# EAGLE design NanoRS485-MySens-v008 (EAGLE 7.6.0)
MAPLE-CUx Large Version
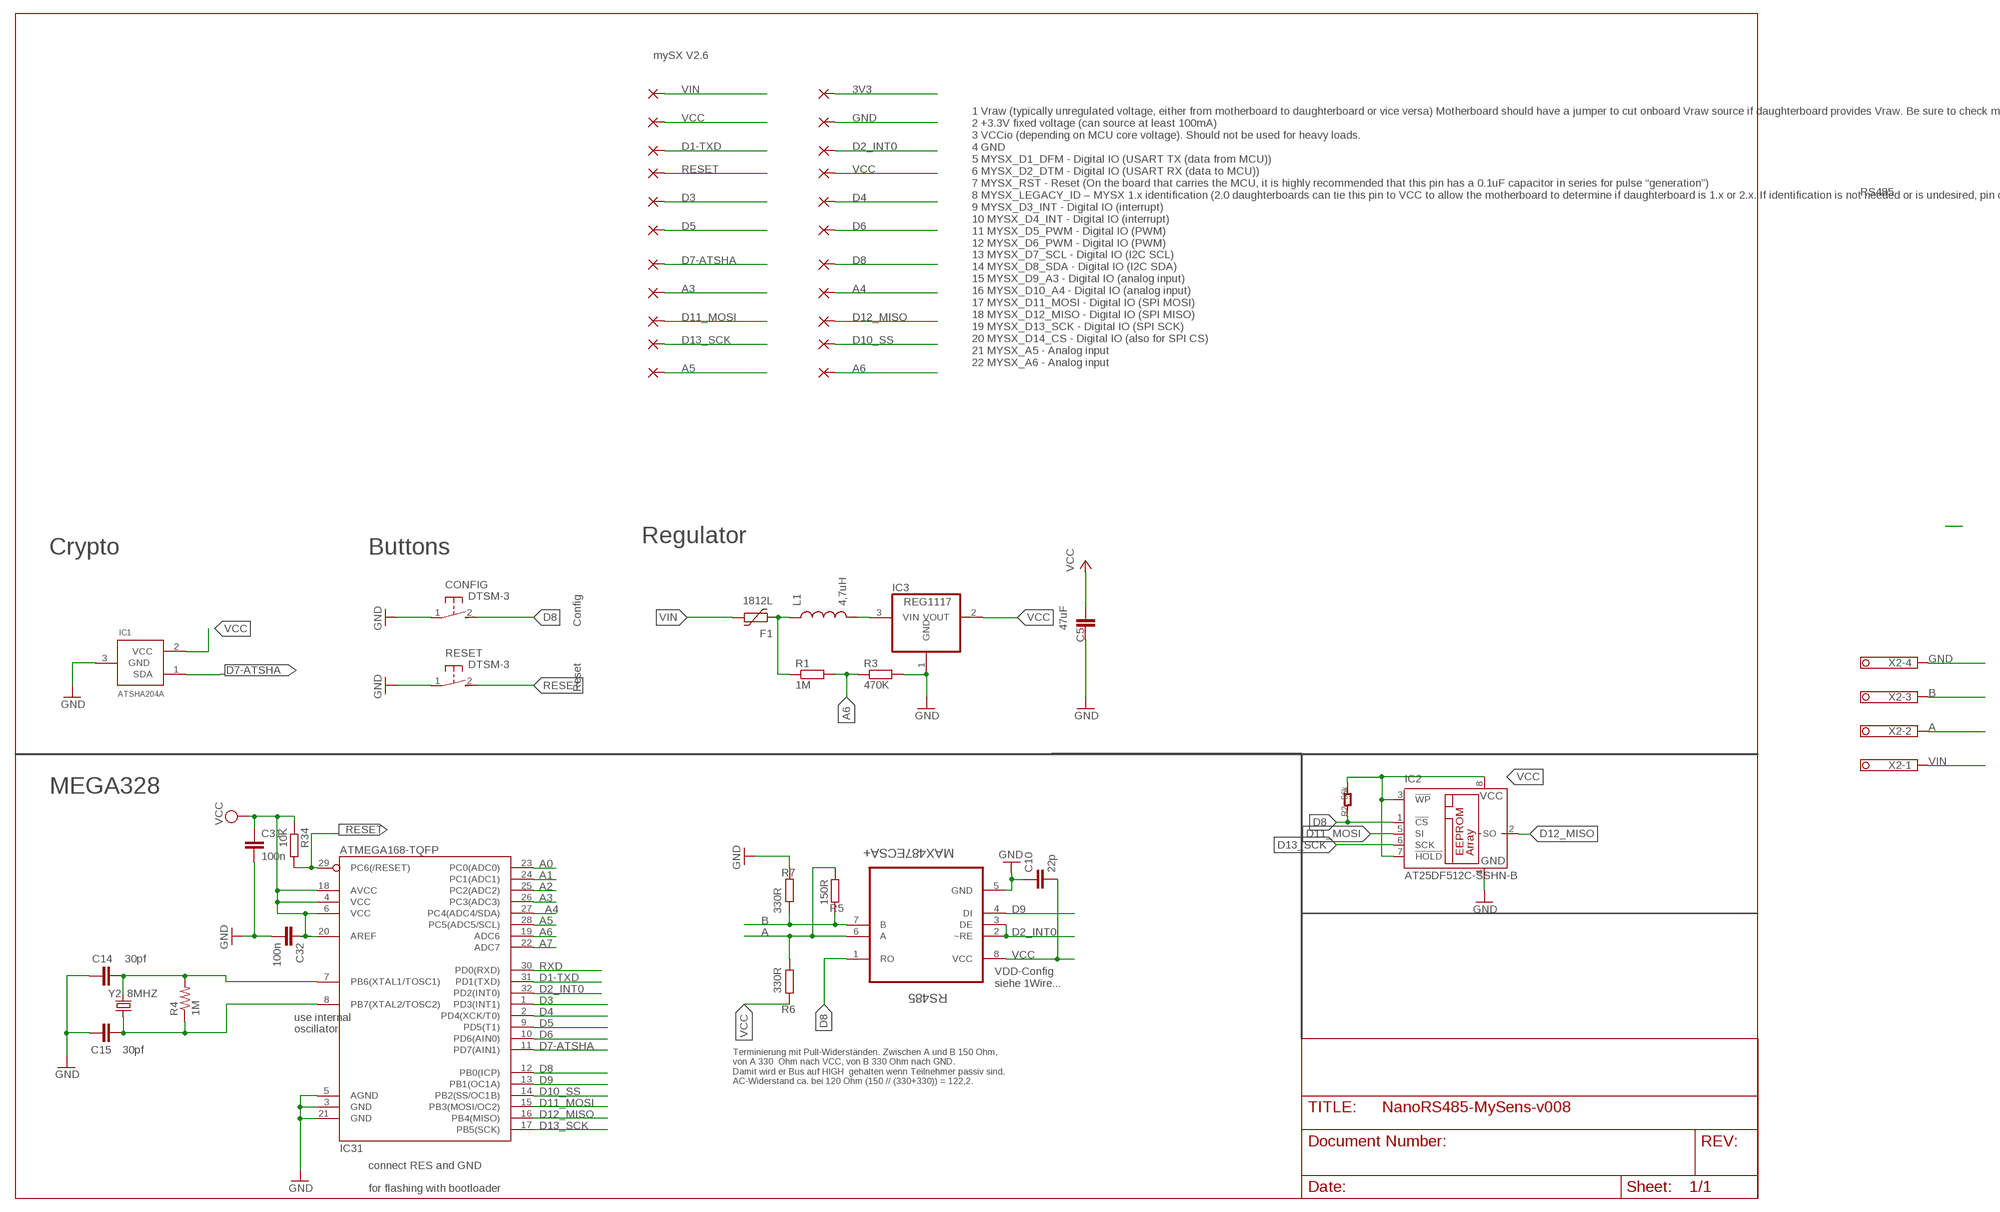
[diagram p0: schematic, sheet 1]

## Parts
3V3  WIREPADSMD1,27-254  [SMD1,27-2,54]
A3  WIREPADSMD1,27-254  [SMD1,27-2,54]
A4  WIREPADSMD1,27-254  [SMD1,27-2,54]
A5  WIREPADSMD1,27-254  [SMD1,27-2,54]
A6  WIREPADSMD1,27-254  [SMD1,27-2,54]
C5  47uF  C-EUC1210  [C1210]
C10  22p  C-EUC0805  [C0805]
C14  30pf  CAP0805  [0805]
C15  30pf  CAP0805  [0805]
C31  100n  C-EUC0805  [C0805]
C32  100n  C-EUC0805  [C0805]
CONFIG  DTSM-3  [DTSM-3]
D1  WIREPADSMD1,27-254  [SMD1,27-2,54]
D2  WIREPADSMD1,27-254  [SMD1,27-2,54]
D3  WIREPADSMD1,27-254  [SMD1,27-2,54]
D4  WIREPADSMD1,27-254  [SMD1,27-2,54]
D5  WIREPADSMD1,27-254  [SMD1,27-2,54]
D6  WIREPADSMD1,27-254  [SMD1,27-2,54]
D7  WIREPADSMD1,27-254  [SMD1,27-2,54]
D8  WIREPADSMD1,27-254  [SMD1,27-2,54]
D10-SS  WIREPADSMD1,27-254  [SMD1,27-2,54]
D11  WIREPADSMD1,27-254  [SMD1,27-2,54]
D12  WIREPADSMD1,27-254  [SMD1,27-2,54]
D13-SCK  WIREPADSMD1,27-254  [SMD1,27-2,54]
F1  1812L  [1812L]
GND  WIREPADSMD1,27-254  [SMD1,27-2,54]
IC1  ATSHA204A  [SOT23]
IC2  AT25DF512C-SSHN-B  25AA080SN  [SO-08]
IC3  REG1117  [SOT223]
IC31  ATMEGA168-TQFP  [TQFP32-08]
L1  4,7uH  INDUCTOR0805  [0805]
R1  1M  R-EU_R0805  [R0805]
R2  56k  R-0402  [R0402]
R3  470K  R-EU_R0805  [R0805]
R4  1M  RESISTOR0805-RES  [0805]
R5  150R  R-EU_R0805  [R0805]
R6  330R  R-EU_R0805  [R0805]
R7  330R  R-EU_R0805  [R0805]
R34  10K  R-EU_R0805  [R0805]
RES  WIREPADSMD1,27-254  [SMD1,27-2,54]
RESET  DTSM-3  [DTSM-3]
RS485  MAX487ECSA+  [SOIC127P600X175-8N]
VCC  WIREPADSMD1,27-254  [SMD1,27-2,54]
VCC-LEGACY  WIREPADSMD1,27-254  [SMD1,27-2,54]
VIN  WIREPADSMD1,27-254  [SMD1,27-2,54]
X2  1751264  [1751264]
Y2  8MHZ  CRYSTALTXC-7A  [CRYSTAL-TXC-7A]

## Nets
3V3 [PWR]: 3V3.1(P)
A: R5.1 R6.2 RS485.6(A) X2.2
A0: IC31.23(PC0(ADC0))
A1: IC31.24(PC1(ADC1))
A2: IC31.25(PC2(ADC2))
A3: A3.1(P) IC31.26(PC3(ADC3))
A4: A4.1(P) IC31.27(PC4(ADC4/SDA))
A5: A5.1(P) IC31.28(PC5(ADC5/SCL))
A6: A6.1(P) IC31.19(ADC6) R1.2 R3.1
A7: IC31.22(ADC7)
B: R5.2 R7.1 RS485.7(B) X2.3
D1-TXD: D1.1(P) IC31.31(PD1(TXD))
D2_INT0: D2.1(P) IC31.32(PD2(INT0)) RS485.2(~RE) RS485.3(DE)
D3: D3.1(P) IC31.1(PD3(INT1))
D4: D4.1(P) IC31.2(PD4(XCK/T0))
D5: D5.1(P) IC31.9(PD5(T1))
D6: D6.1(P) IC31.10(PD6(AIN0))
D7-ATSHA: D7.1(P) IC1.1(SDA) IC31.11(PD7(AIN1))
D8: CONFIG.2 D8.1(P) IC2.1(!CS) IC31.12(PB0(ICP)) R2.1 RS485.1(RO)
D9: IC31.13(PB1(OC1A)) RS485.4(DI)
D10_SS: D10-SS.1(P) IC31.14(PB2(SS/OC1B))
D11_MOSI: D11.1(P) IC2.5(SI) IC31.15(PB3(MOSI/OC2))
D12_MISO: D12.1(P) IC2.2(SO) IC31.16(PB4(MISO))
D13_SCK: D13-SCK.1(P) IC2.6(SCK) IC31.17(PB5(SCK))
GND [PWR]: C5.1 C10.1 C14.1 C15.1 C31.2 C32.2 CONFIG.1 GND.1(P) IC1.3(GND) IC2.4(GND) IC3.1(GND) IC31.3(GND) IC31.5(AGND) IC31.21(GND) R3.2 R7.2 RESET.1 RS485.5(GND) X2.4
N$3: C14.2 IC31.7(PB6(XTAL1/TOSC1)) R4.2 Y2.P$2
N$19: C15.2 IC31.8(PB7(XTAL2/TOSC2)) R4.1 Y2.P$1
RAW: IC3.3(VIN) L1.2
RESET: IC31.29(PC6(/RESET)) R34.2 RES.1(P) RESET.2
RXD: IC31.30(PD0(RXD))
VCC [PWR]: C5.2 C10.2 C31.1 C32.1 IC1.2(VCC) IC2.3(!WP) IC2.7(!HOLD) IC2.8(VCC) IC3.2(VOUT) IC31.4(VCC) IC31.6(VCC) IC31.18(AVCC) IC31.20(AREF) R2.2 R6.1 R34.1 RS485.8(VCC) VCC-LEGACY.1(P) VCC.1(P)
VIN [PWR]: F1.P$2 VIN.1(P) X2.1
VIN-FUSED [PWR]: F1.P$1 L1.1 R1.1

## Notes on the sheet
- mySX V2.6
- RS485
- 1 Vraw (typically unregulated voltage, either from motherboard to daughterboard or vice versa) Motherboard should have a jumper to cut onboard Vraw source if daughterboard provides Vraw. Be sure to check motherboard constraints on Vraw before connecting a daughterboard that provides Vraw (for over voltage protection). Should be able to source at least 100mA and all boards are recommended to support a voltage up to 24V on this pin.
  2 +3.3V fixed voltage (can source at least 100mA)
  3 VCCio (depending on MCU core voltage). Should not be used for heavy loads.
  4 GND
  5 MYSX_D1_DFM - Digital IO (USART TX (data from MCU))
  6 MYSX_D2_DTM - Digital IO (USART RX (data to MCU))
  7 MYSX_RST - Reset (On the board that carries the MCU, it is highly recommended that this pin has a 0.1uF capacitor in series for pulse “generation”)
  8 MYSX_LEGACY_ID – MYSX 1.x identification (2.0 daughterboards can tie this pin to VCC to allow the motherboard to determine if daughterboard is 1.x or 2.x. If identification is not needed or is undesired, pin can be used as regular analog input)
  9 MYSX_D3_INT - Digital IO (interrupt)
  10 MYSX_D4_INT - Digital IO (interrupt)
  11 MYSX_D5_PWM - Digital IO (PWM)
  12 MYSX_D6_PWM - Digital IO (PWM)
  13 MYSX_D7_SCL - Digital IO (I2C SCL)
  14 MYSX_D8_SDA - Digital IO (I2C SDA)
  15 MYSX_D9_A3 - Digital IO (analog input)
  16 MYSX_D10_A4 - Digital IO (analog input)
  17 MYSX_D11_MOSI - Digital IO (SPI MOSI)
  18 MYSX_D12_MISO - Digital IO (SPI MISO)
  19 MYSX_D13_SCK - Digital IO (SPI SCK)
  20 MYSX_D14_CS - Digital IO (also for SPI CS)
  21 MYSX_A5 - Analog input
  22 MYSX_A6 - Analog input
- Regulator
- Crypto | Buttons
- Config
- Reset
- MEGA328
- VDD-Config
  siehe 1Wire...
- use internal
- oscillator
- Terminierung mit Pull-Widerständen. Zwischen A und B 150 Ohm,
  von A 330  Ohm nach VCC, von B 330 Ohm nach GND. 
  Damit wird er Bus auf HIGH  gehalten wenn Teilnehmer passiv sind.
  AC-Widerstand ca. bei 120 Ohm (150 // (330+330)) = 122,2.
- connect RES and GND
- for flashing with bootloader

## Library data of the parts
3V3 A3-A6 D1-D8 D10-SS D11 D12 D13-SCK GND RES VCC VCC-LEGACY VIN = wirepad:WIREPAD: Wire PAD connect wire on PCB
C5 C10 C31 C32 = rcl:C-EU: CAPACITOR, European symbol
C14 C15 = doug:CAP: Capacitor Standard 0603 ceramic capacitor, and 0.1" leaded capacitor.
CONFIG RESET = mechanics:DTSM-3: Diptronics SMD button 6x3.5 mm
F1 = ptc-littlefuse:1812L
IC1 = Sensor:ATSHA204A
IC2 = microchip:25*: Serial EEPROM 4K/ 8K , SPI bus; MF: MICROCHIP; MPN: 25AA080/SN; OC_FARNELL: 1816072; OC_NEWARK: 92C7351
IC3 = burr-brown:REG1117: 800mA and 1A Low Dropout (LDO) Positive Regulator 1.8V, 2.5V, 2.85V, 3.3V, 5V, and Adj; MPN: REG1117; OC_FARNELL: 1097566; OC_NEWARK: 14P6981
IC31 = atmel:ATMEGA168: Atmel Atmega 168/328/328P
L1 = SparkFun-Passives:INDUCTOR: Inductors Basic Inductor/Choke - 0603 and 1206. Footprints are not proven and vary greatly between part numbers.
R1 R3 R5-R7 R34 = rcl:R-EU_: RESISTOR, European symbol
R2 = Discrete:R*
R4 = doug:RESISTOR: Resistor Basic schematic elements and footprints for 0603, 1206, and PTH resistors.
RS485 = Maxim_By_element14_Batch_1:MAX487ECSA+: Low-Power, Slew-Rate-Limited RS-485/RS-422 Transceivers; MPN: MAX487ECSA+; OC_FARNELL: 9724532; OC_NEWARK: 68K4803; PACKAGE: SOIC-8; SUPPLIER: Maxim
X2 = con-phoenix-350:1751264: MKDS 1/ 4-3,5 Printklemme Nennstrom: 10 A Bemessungsspannung: 160 V Raster: 3,5 mm Polzahl: 4 Montageart: Löten Anschlussart: Schraubanschluss Anschlussrichtung vom Leiter zur Platine: 0° Source: http://eshop.phoenixcontact.com .. 1751264.pdf; MPN: 1751264; OC_FARNELL: unknown; OC_NEWARK: 10R0934
Y2 = SparkFun-FreqCtrl:CRYSTAL: Various standard crystals. Proven footprints.

## Net classes
0 default: width 0.254 mm
1 PWR: width 0.406 mm

## Board
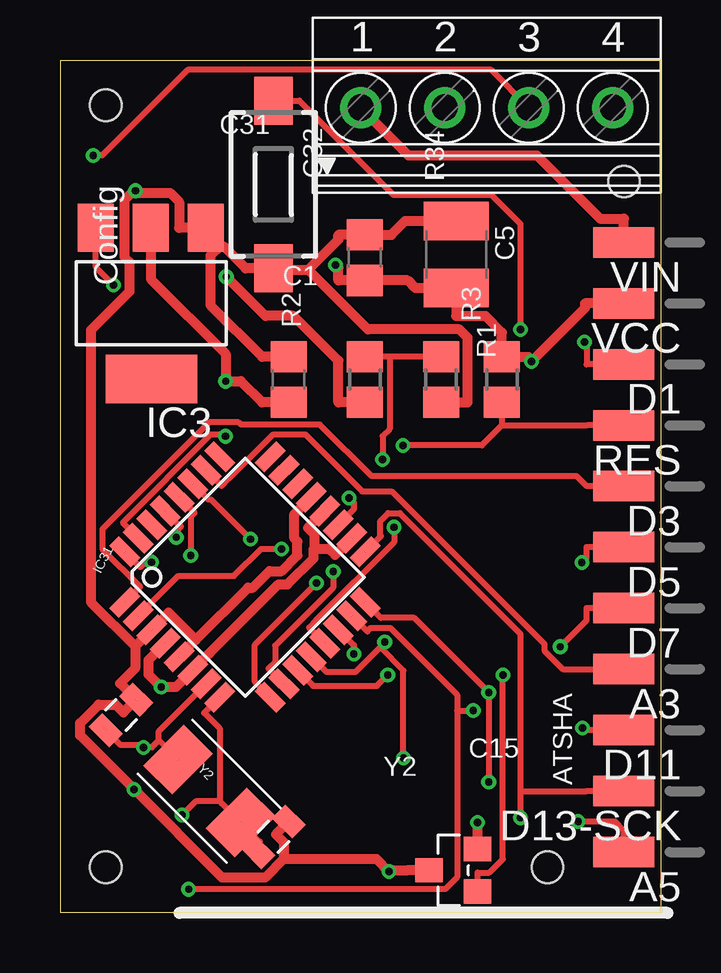
[diagram p1: board, top side]
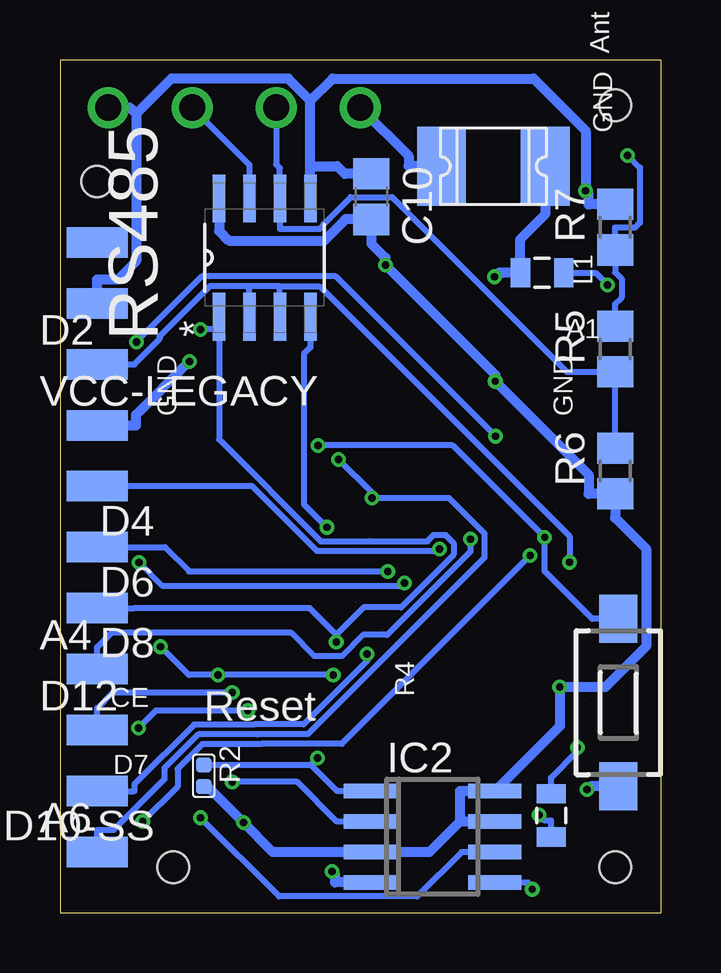
[diagram p2: board, bottom side, seen from below]

Size 25.04 x 35.54 mm. Coordinates in mm from the lower left corner, seen from the top.
Outline: 25.04,35.54 25.04,0 0,0 0,35.54 25.04,35.54
Copper layers (1*16): Top 0.035mm / dielectric 1.5mm / Bottom 0.035mm
Design rules "SeeedStudio_2layer_DRU_no_angle_20140221": minimum track width 6mil, minimum drill 12mil, track to track 6mil, track to pad 6mil, pad to pad 6mil, via to via 6mil, smd to smd 0mil, copper to edge 10mil, drill to drill 10mil, minimum pad ring 10mil, minimum via ring 6mil, stop-mask expansion 2mil, vias tented up to drill 100mil, thermal gap 10mil
Holes 1.3 mm at 23.5,30.48 1.91,33.66 20.32,1.91 1.91,1.91

### Footprints (pad centres in the part's own frame; a part is rotated, then mirrored left to right if it is on the bottom)
SMD1,27-2,54 = smd 1.27 x 2.54: 1 0,0
C1210 = smd 1.6 x 2.7: 1 -1.4,0; 2 1.4,0
C0805 = smd 1.3 x 1.5: 1 -0.95,0; 2 0.95,0
0805 = smd 0.8 x 1.2: 1 -0.9,0; 2 0.9,0
DTSM-3 = smd 2 x 1.6: 1 -3.494,0; 2 3.494,0
1812L = smd 2.03 x 3.3: P$1 -2.16,0; P$2 2.16,0
SOT23 = smd 1.016 x 1.143: 1 -0.889,-1.016; 2 0.889,-1.016; 3 0,1.016
SO-08 = smd 0.6 x 2.2: 1 -1.905,-2.6; 2 -0.635,-2.6; 3 0.635,-2.6; 4 1.905,-2.6; 5 1.905,2.6; 6 0.635,2.6; 7 -0.635,2.6; 8 -1.905,2.6
SOT223 = smd 1.499 x 2.007: 1 -2.261,-3.15; 2 0.025,-3.15; 3 2.311,-3.15 | smd 3.81 x 2.007: 4 0,3.15
TQFP32-08 = smd 1.27 x 0.559: 1 -4.293,2.8; 2 -4.293,2; 3 -4.293,1.2; 4 -4.293,0.4; 5 -4.293,-0.4; 6 -4.293,-1.2; 7 -4.293,-2; 8 -4.293,-2.8; 17 4.293,-2.8; 18 4.293,-2; 19 4.293,-1.2; 20 4.293,-0.4; 21 4.293,0.4; 22 4.293,1.2; 23 4.293,2; 24 4.293,2.8 | smd 0.559 x 1.27: 9 -2.8,-4.293; 10 -2,-4.293; 11 -1.2,-4.293; 12 -0.4,-4.293; 13 0.4,-4.293; 14 1.2,-4.293; 15 2,-4.293; 16 2.8,-4.293; 25 2.8,4.293; 26 2,4.293; 27 1.2,4.293; 28 0.4,4.293; 29 -0.4,4.293; 30 -1.2,4.293; 31 -2,4.293; 32 -2.8,4.293
R0805 = smd 1.3 x 1.5: 1 -0.95,0; 2 0.95,0
R0402 = smd 0.635 x 0.635: 1 0,0.445; 2 0,-0.445
SOIC127P600X175-8N = smd 1.981 x 0.533: 1 -2.464,1.905; 2 -2.464,0.635; 3 -2.464,-0.635; 4 -2.464,-1.905; 5 2.464,-1.905; 6 2.464,-0.635; 7 2.464,0.635; 8 2.464,1.905
1751264 = drill 1.1 pad 1.7: 1 -5.25,-0.1; 2 -1.75,-0.1; 3 1.75,-0.1; 4 5.25,-0.1
CRYSTAL-TXC-7A = smd 1.7 x 2.4: P$1 1.85,0; P$2 -1.85,0

### Placement (x,y rotation side)
3V3  23.5,27.94 90 bottom
A3  23.5,10.16 90 top
A4  23.5,10.16 270 bottom
A5  23.5,2.54 90 top
A6  23.5,2.54 270 bottom
C5  16.51,27.43 270 top
C10  12.06,29.84 270 bottom
C14  2.54,8.26 225 top
C15  8.89,3.17 225 top
C31  12.7,27.3 90 top
C32  9.53,22.23 90 top
CONFIG  8.89,30.35 90 top
D1  23.5,22.86 90 top
D2  23.5,22.86 270 bottom
D3  23.5,17.78 90 top
D4  23.5,17.78 90 bottom
D5  23.5,15.24 90 top
D6  23.5,15.24 90 bottom
D7  23.5,12.7 90 top
D8  23.5,12.7 90 bottom
D10-SS  23.5,5.08 90 bottom
D11  23.5,7.62 90 top
D12  23.5,7.62 270 bottom
D13-SCK  23.5,5.08 90 top
F1  6.99,31.11 180 bottom
GND  23.5,25.4 90 bottom
IC1  16.38,1.78 90 top
IC2  9.53,3.17 270 bottom
IC3  3.81,25.4 180 top
IC31  7.71,14 45 top
L1  4.95,26.67 0 bottom
R1  12.7,22.23 90 top
R2  19.05,5.71 0 bottom
R3  15.88,22.23 270 top
R4  4.57,4.06 90 bottom
R5  1.91,23.5 90 bottom
R6  1.91,18.41 90 bottom
R7  1.91,28.57 90 bottom
R34  18.41,22.23 270 top
RES  23.5,20.32 90 top
RESET  1.78,8.76 90 bottom
RS485  16.51,27.3 90 bottom
VCC  23.5,25.4 90 top
VCC-LEGACY  23.5,20.32 270 bottom
VIN  23.5,27.94 90 top
X2  17.78,33.66 0 top
Y2  6.22,5.08 315 top

### Tracks (layer width: path | path; a pad name or v marks a point on that pad's centre or on a via)
A
  Bottom 0.254: R6.2 R5.1 3.92,22.55 11.2,29.82 12.93,29.82 14.06,28.7 14.06,28.66 14.22,28.5 15.88,28.5 RS485.6 15.88,30.3 15.88,31.04 16.03,31.19 X2.2
A3  (1 unrouted)
  Top 0.254: IC31.26 6.74,17.8 7.02,18.08 7.03,18.08 8.89,19.94 10.22,19.94 12.59,17.57 13.82,17.57 20.18,11.21 20.18,10.93 20.95,10.16 A3.1
A4  (via drill 0.3 pad 0.61)  (1 unrouted)
  Top 0.254: IC31.27 6.17,17.23 6.28,17.23 v7.94,15.57
  Bottom 0.254: v7.94,15.57 7.94,15.05 11.41,11.59 12.41,11.59 13.29,10.71 14.44,10.71 15.41,11.68 22.89,11.68 23.5,11.07 A4.1
A5  (via drill 0.3 pad 0.61)  (1 unrouted)
  Top 0.254: IC31.28 5.61,16.67 5.45,16.51 v5.45,14.89 | v21.59,3.82 23.13,3.82 23.5,3.45 A5.1
  Bottom 0.254: v5.45,14.89 13.3,7.05 16.63,7.05 16.64,7.04 19.11,7.04 20.14,6 20.14,5.27 v21.59,3.82
A6  (via drill 0.3 pad 0.61)  (1 unrouted)
  Top 0.254: 13.73,23.18 13.73,20.16 13.44,19.87 v13.44,18.9 | 13.73,23.18 R1.2 | R3.1 13.73,23.18 | v12.04,17.3 12.24,17.09 12.24,16.83 IC31.19
  Bottom 0.254: v13.44,18.9 12.04,17.5 v12.04,17.3 8.83,17.3 7.36,15.82 7.36,14.81 14.71,7.45 16.8,7.45 16.81,7.44 19.28,7.44 20.69,6.03 20.69,5.58 22.82,3.45 23.5,3.45 A6.1
B  (via drill 0.3 pad 0.61)
  Top 0.254: X2.3 17.96,35.13 5.31,35.13 1.75,31.57 v1.39,31.57
  Bottom 0.254: X2.3 17.14,31.17 RS485.7 | v1.39,31.57 0.88,31.05 0.88,28.76 1.08,28.55 1.91,28.55 R7.1 1.91,26.7 1.64,26.43 1.64,25.64 1.91,25.37 R5.2
D1-TXD  (via drill 0.3 pad 0.61)  (1 unrouted)
  Top 0.254: v21.86,23.79 21.95,23.7 21.95,22.86 D1.1 | v6.89,19.86 6.81,19.94 6.29,19.94 2.62,16.26 IC31.31
  Bottom 0.254: v6.89,19.86 13.55,26.52 19.12,26.52 v21.86,23.79
D2_INT0  (via drill 0.3 pad 0.61)  (1 unrouted)
  Top 0.254: IC31.32 3.34,14.4 3.55,14.62 v3.81,14.62
  Bottom 0.254: 15.88,26.11 14.22,26.11 3.81,15.7 v3.81,14.62 | 15.88,26.11 15.88,26.01 RS485.3 | 15.88,26.11 17.14,26.11 | 17.14,26.11 18.8,26.11 20.89,24.03 20.89,23.92 21.95,22.86 D2.1 | RS485.2 17.14,26.11
D3  (1 unrouted)
  Top 0.254: D3.1 21.95,17.78 21.53,18.2 12.98,18.2 10.83,20.35 7.55,20.35 7.45,20.45 6.22,20.45 1.77,16 1.77,15.16 3.34,13.59 IC31.1
D4  (via drill 0.3 pad 0.61)  (1 unrouted)
  Top 0.254: IC31.2 4.93,14.04 7.25,14.04 8.38,15.17 v9.23,15.17
  Bottom 0.254: v9.23,15.17 9.32,15.08 14.33,15.08 17.03,17.78 D4.1
D5  (via drill 0.3 pad 0.61)  (1 unrouted)
  Top 0.254: v10.69,13.74 8.12,11.18 8.12,9.63 IC31.9 | v21.74,14.61 21.95,14.81 21.95,15.24 D5.1
  Bottom 0.254: v21.74,14.61 20.78,13.64 10.79,13.64 v10.69,13.74
D6  (via drill 0.3 pad 0.61)  (1 unrouted)
  Top 0.254: IC31.10 8.69,10.19 8.97,10.47 8.97,11.13 11.38,13.55 v11.38,14.23
  Bottom 0.254: D6.1 20.67,15.24 19.66,14.23 v11.38,14.23
D7-ATSHA  (via drill 0.3 pad 0.61)  (1 unrouted)
  Top 0.254: D7.1 21.95,12.7 21.95,12.19 v20.85,11.09 | v18.45,9.92 18.45,2.25 17.88,1.68 17.4,1.68 IC1.1 | IC31.11 10.54,9.47 13.21,9.47 v13.66,9.92
  Bottom 0.254: v20.85,11.09 19.67,9.92 v18.45,9.92 v13.66,9.92
D8  (via drill 0.3 pad 0.61)  (1 unrouted)
  Top 0.254: 13.34,11.06 12.31,10.03 11.11,10.03 IC31.12 | v13.53,11.29 13.53,11.26 13.34,11.06 | v14.31,6.46 14.31,10.1 13.34,11.06 | v19.19,24.32 19.19,28.7 17.98,29.91 13.9,29.91 9.97,33.85 CONFIG.2
  Bottom 0.254: 18.41,24.32 18.41,19.74 14.16,15.49 9.73,15.49 9.47,15.75 8.98,15.75 8.64,15.41 8.64,14.93 10.83,12.74 12.39,12.74 13.53,11.6 | 14.58,6.18 v14.31,6.46 | 14.58,6.18 13.5,5.1 13.5,5.08 IC2.1 | R2.1 19.03,6.18 14.58,6.18 | 13.53,11.6 v13.53,11.29 | 13.53,11.6 14.63,12.7 21.95,12.7 D8.1 | RS485.1 18.41,24.32 | 18.41,24.32 v19.19,24.32
D9  (via drill 0.3 pad 0.61)  (1 unrouted)
  Top 0.254: IC31.13 10.38,11.89 10.66,12.17 10.66,12.19 13.92,15.45 v13.92,16.07
  Bottom 0.254: RS485.4 14.61,23.57 14.88,23.3 14.88,17.03 v13.92,16.07
D10_SS  (via drill 0.3 pad 0.61)  (1 unrouted)
  Top 0.254: v12.24,10.79 12.24,11.16 IC31.14
  Bottom 0.254: v12.24,10.79 12.24,10.51 14.89,7.86 16.96,7.86 16.98,7.85 19.45,7.85 21.95,5.35 21.95,5.08 D10-SS.1
D11_MOSI  (via drill 0.3 pad 0.61)  (1 unrouted)
  Top 0.254: 16.55,8.43 16.55,1.48 16.05,0.99 v5.36,0.99 | 16.55,8.43 16.55,9.1 13.77,11.88 12.96,11.88 12.81,11.73 IC31.15 | 16.55,8.43 v17.22,8.43 | v21.76,7.71 21.86,7.71 21.95,7.62 D11.1
  Bottom 0.254: v17.22,8.43 21.04,8.43 v21.76,7.71 | IC2.5 5.55,1.27 5.55,1.17 v5.36,0.99
D12_MISO  (via drill 0.3 pad 0.61)  (1 unrouted)
  Top 0.254: v17.86,5.46 v17.86,9.19 14.76,12.29 13.37,12.29 IC31.16
  Bottom 0.254: v17.86,9.19 22.84,9.19 23.5,8.53 D12.1 | v17.86,5.46 15.16,5.46 13.5,3.81 IC2.2
D13_SCK  (via drill 0.3 pad 0.61)  (1 unrouted)
  Top 0.254: 19.19,5.08 19.19,11.63 14.16,16.66 13.68,16.66 13.33,16.31 13.33,15.74 13.37,15.7 IC31.17 | 19.19,5.08 v19.19,3.97 | 19.19,5.08 21.95,5.08 D13-SCK.1
  Bottom 0.254: v19.19,3.97 15.91,0.69 10.15,0.69 8.3,2.54 IC2.6
GND  (via drill 0.3 pad 0.61)  (4 unrouted)
  Top 0.406: 5.66,11.38 7.84,13.56 8.03,13.56 8.72,14.24 9.24,14.24 9.89,14.89 9.89,15.48 9.76,15.61 9.76,16.61 | 9.76,16.61 | 3.14,30 2.98,30 2.68,29.7 2.68,27.33 2.89,27.12 2.89,25.89 1.28,24.29 1.28,12.95 3.13,11.11 | 6.65,27.78 6.27,27.4 6.27,25.33 8.42,23.18 C32.2 | 6.65,27.78 6.81,27.78 7.73,26.86 CONFIG.1 9.47,26.86 9.52,26.8 10.34,26.8 | 6.65,27.78 6.07,28.36 IC3.1 4.97,28.55 4.97,29.63 4.59,30 3.14,30 | v3.14,30.09 3.14,30 | 3.13,11.11 3.13,10.19 2.5,9.57 C14.1 2.64,8.36 2.32,8.68 1.61,8.68 0.84,7.91 0.84,7.39 v3.08,5.15 6.76,1.48 8.54,1.48 9.32,2.25 | 3.13,11.11 IC31.3 4.53,12.51 5.66,11.38 | 9.32,2.25 13.18,2.25 v13.7,1.73 13.76,1.78 14.44,1.78 IC1.3 | 9.32,2.25 9.32,2.95 8.99,3.28 C15.1 | 10.34,26.8 12.83,24.32 16.64,24.32 16.98,23.97 16.98,21.27 R3.2 | IC31.21 9.76,16.61 | IC31.5 5.66,11.38 | 10.34,26.8 11.59,28.05 11.59,28.25 C31.2 13.81,28.25 14.38,28.83 C5.1
  Bottom 0.406: IC2.4 13.58,1.27 13.58,1.6 v13.7,1.73 | 21.87,33.29 21.87,27.16 22.64,26.39 23.5,26.39 GND.1 | X2.4 22.13,33.55 21.87,33.29 | 14.61,33.84 15.53,34.76 20.4,34.76 21.87,33.29 | 14.61,33.84 13.68,34.76 5.3,34.76 3.14,32.6 v3.14,30.09 3.01,29.96 3.01,29.52 R7.2 | 14.61,31.11 14.61,33.84 | 14.61,31.11 13.49,31.11 13.17,30.8 C10.1 | RS485.5 14.61,31.11 | v3.08,5.15 3.05,5.15 2.93,5.27 RESET.1
N$3  (via drill 0.3 pad 0.61)  (3 unrouted)
  Top 0.254: 4.12,7.19 4.12,7.57 5.44,8.9 IC31.7 | 4.12,7.19 4.18,7.13 Y2.P$2 | 4.12,7.19 3.83,6.89 v3.48,6.89 3.38,7 2.52,7 C14.2
  Bottom 0.254: R4.2 4.57,5.64 3.48,6.73 v3.48,6.89
N$19  (via drill 0.3 pad 0.61)  (3 unrouted)
  Top 0.254: 6.65,4.65 5.65,4.65 v5.09,4.08 | 6.65,4.65 6.66,4.65 6.73,4.57 Y2.P$1 8.33,2.97 8.25,2.9 C15.2 | 6.65,4.65 6.65,7.7 6.01,8.33 IC31.8
  Bottom 0.254: R4.1 4.57,3.84 4.85,3.84 v5.09,4.08
RAW  (via drill 0.3 pad 0.61)
  Top 0.254: v2.23,26.17 1.5,26.9 IC3.3
  Bottom 0.254: L1.2 2.73,26.67 v2.23,26.17
RESET  (via drill 0.3 pad 0.61)  (1 unrouted)
  Top 0.254: 18.41,20.32 17.58,19.48 v14.29,19.48 | v4.84,15.65 4.84,15.91 5.04,16.1 IC31.29 | 18.41,20.32 18.41,20.81 R34.2 | 18.41,20.32 21.95,20.32 RES.1
  Bottom 0.254: v14.29,19.48 8.68,19.48 v4.84,15.65 4.84,14.24 2.86,12.26 RESET.2
VCC  (via drill 0.3 pad 0.61)  (3 unrouted)
  Top 0.406: VCC.1 21.87,25.4 21.87,25.2 v19.65,22.98 19.52,23.11 19.52,23.18 R34.1 18.41,24.18 17.72,24.88 16.51,24.88 C5.2 15.66,26.03 14.8,26.03 14.48,26.36 C31.1 11.59,26.36 11.59,26.89 v11.48,27 | 10.59,15.18 10.57,15.15 10.57,14.77 9.48,13.69 9.1,13.69 6.23,10.81 IC31.6 4.83,9.41 v4.22,9.41 3.69,9.94 3.69,10.54 IC31.4 | IC31.20 10.33,16.05 10.59,15.78 10.59,15.18 | 10.59,15.18 11.2,15.18 11.46,14.92 IC31.18 | C32.1 8.42,21.27 7.54,22.16 v6.9,22.16 6.9,23.3 3.79,26.41 IC3.2 | v17.4,3.77 17.4,3.53 IC1.2
  Bottom 0.406: VCC-LEGACY.1 21.87,20.32 21.87,20.76 v19.65,22.98 | R2.2 18.9,5.27 v17.4,3.77 16.17,2.54 13.58,2.54 IC2.3 9.65,2.54 8.38,3.81 | RS485.8 18.41,28.42 18.01,28.02 14.02,28.02 13.17,28.86 13.17,28.89 C10.2 12.06,27.89 11.48,27.3 v11.48,27 6.9,22.42 v6.9,22.16 3.01,18.26 3.01,17.46 R6.1 1.91,16.46 0.62,15.18 0.62,11.11 2.32,9.41 v4.22,9.41 4.22,7.79 IC2.8 8.38,5.08 8.38,3.81 | IC2.7 8.38,3.81
VIN
  Top 0.406: VIN.1 23.5,28.93 22.5,28.93 19.86,31.57 14.52,31.57 X2.1
  Bottom 0.406: F1.P$2 10.52,31.11 10.52,31.54 X2.1
VIN-FUSED  (via drill 0.3 pad 0.61)
  Top 0.406: v6.93,26.51 8.56,24.88 9.73,24.88 11.59,23.01 11.59,21.27 R1.1
  Bottom 0.406: v6.93,26.51 6.77,26.67 6.61,26.67 L1.1 5.85,28.08 4.83,29.11 F1.P$1

### Text on the board
tNames: easyMySensors-RFM69, RFM95 / by Ranseyer Micro V0.2 | C31 | C32 | R34 | C5 | Config | C1 | R3 | R2 | R1 | Y2 | C15 | ATSHA
bNames: Ant | GND | A1 | GND | GND | R4 | CE | Reset | D7
tDocu: 1 | 5 | 9 | 13 | 17 | 21 | 1 Vraw (typically unregulated voltage, either from motherboard to daughterboard or vice versa) Motherboard should have a jumper to cut onboard Vraw source if daughterboard provides Vraw. Be sure to check motherboard constraints on Vraw before connecting a daughterboard that provides Vraw (for over voltage protection). Should be able to source at least 100mA and all boards are recommended to support a voltage up to 24V on this pin. / 2 +3.3V fixed voltage (can source at least 100mA) / 3 VCCio (depending on MCU core voltage). Should not be used for heavy loads. / 4 GND / 5 MYSX_D1_DFM - Digital IO (USART TX (data from MCU)) / 6 MYSX_D2_DTM - Digital IO (USART RX (data to MCU)) / 7 MYSX_RST - Reset (On the board that carries the MCU, it is highly recommended that this pin has a 0.1uF capacitor in series for pulse “generation”) / 8 MYSX_LEGACY_ID – MYSX 1.x identification (2.0 daughterboards can tie this pin to VCC to allow the motherboard to determine if daughterboard is 1.x or 2.x. If identification is not needed or is undesired, pin can be used as regular analog input) / 9 MYSX_D3_INT - Digital IO (interrupt) / 10 MYSX_D4_INT - Digital IO (interrupt) / 11 MYSX_D5_PWM - Digital IO (PWM) / 12 MYSX_D6_PWM - Digital IO (PWM) / 13 MYSX_D7_SCL - Digital IO (I2C SCL) / 14 MYSX_D8_SDA - Digital IO (I2C SDA) / 15 MYSX_D9_A3 - Digital IO (analog input) / 16 MYSX_D10_A4 - Digital IO (analog input) / 17 MYSX_D11_MOSI - Digital IO (SPI MOSI) / 18 MYSX_D12_MISO - Digital IO (SPI MISO) / 19 MYSX_D13_SCK - Digital IO (SPI SCK) / 20 MYSX_D14_CS - Digital IO (also for SPI CS) / 21 MYSX_A5 - Analog input / 22 MYSX_A6 - Analog input